# Altium schematic sheet Master_2.SchDoc
size A4
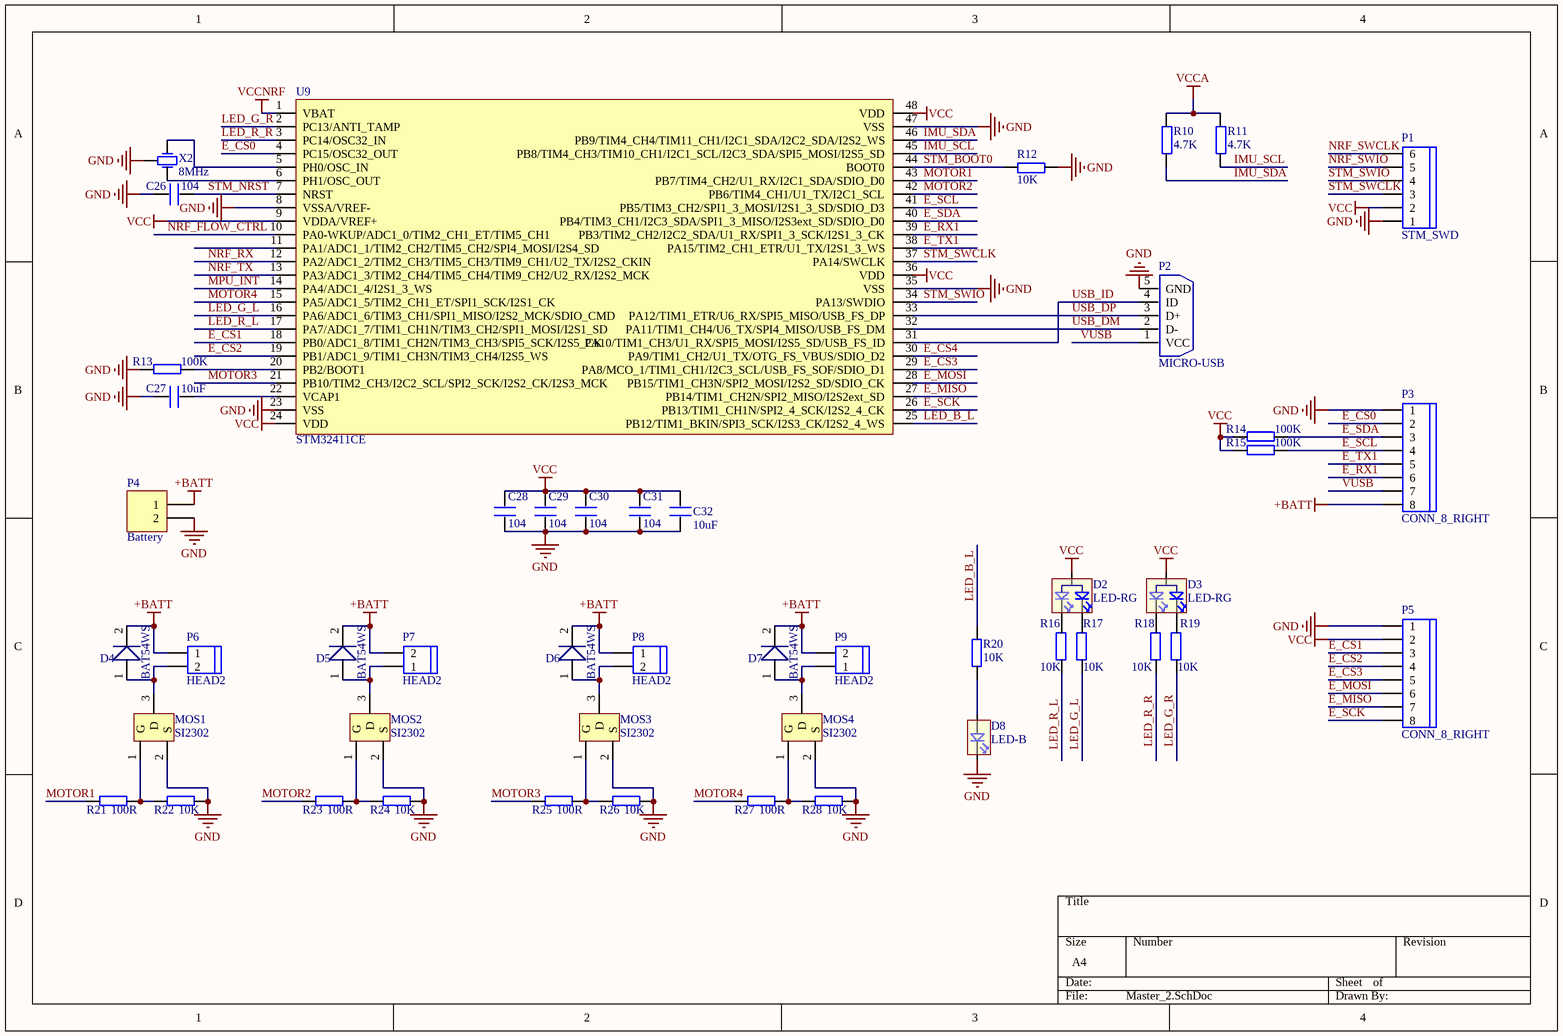
[diagram p0: Master_2.SchDoc]

## Parts
C26  104  [0402]
C27  10uF  [0603P]
C28  104  [0402]
C29  104  [0402]
C30  104  [0402]
C31  104  [0402]
C32  10uF  [0603P]
D2  LED-RG  [LED1206  侧贴]
D3  LED-RG  [LED1206  侧贴]
D4  BAT54WS  [SOD-323]
D5  BAT54WS  [SOD-323]
D6  BAT54WS  [SOD-323]
D7  BAT54WS  [SOD-323]
D8  LED-B  [LED1206  侧贴]
MOS1  SI2302  [SO-G3/C2.5]
MOS2  SI2302  [SO-G3/C2.5]
MOS3  SI2302  [SO-G3/C2.5]
MOS4  SI2302  [SO-G3/C2.5]
P1  STM_SWD  [SH1.0-6P]
P2  MICRO-USB  [MICRO_USB5P_SOP]
P3  CONN_8_RIGHT  [HEADER8-2.0MM-SMD]
P4  Battery  [HDR1X2]
P5  CONN_8_RIGHT  [HEADER8-2.0MM-SMD]
P6  HEAD2  [HEADER2-1.25MM]
P7  HEAD2  [HEADER2-1.25MM]
P8  HEAD2  [HEADER2-1.25MM]
P9  HEAD2  [HEADER2-1.25MM]
R10  4.7K  [0402]
R11  4.7K  [0402]
R12  10K  [0402]
R13  100K  [0402]
R14  100K  [0402]
R15  100K  [0402]
R16  10K  [0402]
R17  10K  [0402]
R18  10K  [0402]
R19  10K  [0402]
R20  10K  [0402]
R21  100R  [0402]
R22  10K  [0402]
R23  100R  [0402]
R24  10K  [0402]
R25  100R  [0402]
R26  10K  [0402]
R27  100R  [0402]
R28  10K  [0402]
U9  STM32411CE  [UFQFPN48]
X2  8MHz  [XTAL3215]

## Nets
+BATT: D4.2 D5.2 D6.2 D7.2 P3.8 P4.1 P6.1 P7.2 P8.1 P9.2
GND: C26.1 C27.1 C28.1 C29.1 C30.1 C31.1 C32.1 D8.1 MOS1.2(S) MOS2.2(S) MOS3.2(S) MOS4.2(S) P1.1 P2.5(GND) P3.1 P4.2 P5.1 R12.2 R13.2 R22.1 R24.1 R26.1 R28.1 U9.8(VSSA/VREF-) U9.23(VSS) U9.35(VSS) U9.47(VSS) X2.2(GND)
VCC: C28.2 C29.2 C30.2 C31.2 C32.2 D2.3 D3.3 P1.2 P5.2 R14.2 R15.2 U9.9(VDDA/VREF+) U9.24(VDD) U9.36(VDD) U9.48(VDD)
VCCA: R10.2 R11.2
VCCNRF: U9.1(VBAT)
E_CS0: P3.2 U9.4(PC15/OSC32_OUT)
E_CS1: P5.3 U9.18(PB0/ADC1_8/TIM1_CH2N/TIM3_CH3/SPI5_SCK/I2S5_CK)
E_CS2: P5.4 U9.19(PB1/ADC1_9/TIM1_CH3N/TIM3_CH4/I2S5_WS)
E_CS3: P5.5 U9.29(PA8/MCO_1/TIM1_CH1/I2C3_SCL/USB_FS_SOF/SDIO_D1)
E_CS4: U9.30(PA9/TIM1_CH2/U1_TX/OTG_FS_VBUS/SDIO_D2)
E_MISO: P5.7 U9.27(PB14/TIM1_CH2N/SPI2_MISO/I2S2ext_SD)
E_MOSI: P5.6 U9.28(PB15/TIM1_CH3N/SPI2_MOSI/I2S2_SD/SDIO_CK)
E_RX1: P3.6 U9.39(PB3/TIM2_CH2/I2C2_SDA/U1_RX/SPI1_3_SCK/I2S1_3_CK)
E_SCK: P5.8 U9.26(PB13/TIM1_CH1N/SPI2_4_SCK/I2S2_4_CK)
E_SCL: P3.4 R15.1 U9.41(PB5/TIM3_CH2/SPI1_3_MOSI/I2S1_3_SD/SDIO_D3)
E_SDA: P3.3 R14.1 U9.40(PB4/TIM3_CH1/I2C3_SDA/SPI1_3_MISO/I2S3ext_SD/SDIO_D0)
E_TX1: P3.5 U9.38(PA15/TIM2_CH1_ETR/U1_TX/I2S1_3_WS)
IMU_SCL: R11.1 U9.45(PB8/TIM4_CH3/TIM10_CH1/I2C1_SCL/I2C3_SDA/SPI5_MOSI/I2S5_SD)
IMU_SDA: R10.1 U9.46(PB9/TIM4_CH4/TIM11_CH1/I2C1_SDA/I2C2_SDA/I2S2_WS)
LED_B_L: R20.1 U9.25(PB12/TIM1_BKIN/SPI3_SCK/I2S3_CK/I2S2_4_WS)
LED_G_L: R17.2 U9.16(PA6/ADC1_6/TIM3_CH1/SPI1_MISO/I2S2_MCK/SDIO_CMD)
LED_G_R: R19.2 U9.2(PC13/ANTI_TAMP)
LED_R_L: R16.2 U9.17(PA7/ADC1_7/TIM1_CH1N/TIM3_CH2/SPI1_MOSI/I2S1_SD)
LED_R_R: R18.2 U9.3(PC14/OSC32_IN)
MOTOR1: R21.2 U9.43(PB7/TIM4_CH2/U1_RX/I2C1_SDA/SDIO_D0)
MOTOR2: R23.2 U9.42(PB6/TIM4_CH1/U1_TX/I2C1_SCL)
MOTOR3: R25.2 U9.21(PB10/TIM2_CH3/I2C2_SCL/SPI2_SCK/I2S2_CK/I2S3_MCK)
MOTOR4: R27.2 U9.15(PA5/ADC1_5/TIM2_CH1_ET/SPI1_SCK/I2S1_CK)
MPU_INT: U9.14(PA4/ADC1_4/I2S1_3_WS)
NRF_FLOW_CTRL: U9.10(PA0-WKUP/ADC1_0/TIM2_CH1_ET/TIM5_CH1)
NRF_RX: U9.12(PA2/ADC1_2/TIM2_CH3/TIM5_CH3/TIM9_CH1/U2_TX/I2S2_CKIN)
NRF_SWCLK: P1.6
NRF_SWIO: P1.5
NRF_TX: U9.13(PA3/ADC1_3/TIM2_CH4/TIM5_CH4/TIM9_CH2/U2_RX/I2S2_MCK)
STM_BOOT0: R12.1 U9.44(BOOT0)
STM_NRST: C26.2 U9.7(NRST)
STM_SWCLK: P1.3 U9.37(PA14/SWCLK)
STM_SWIO: P1.4 U9.34(PA13/SWDIO)
USB_DM: P2.2(D-) U9.32(PA11/TIM1_CH4/U6_TX/SPI4_MISO/USB_FS_DM)
USB_DP: P2.3(D+) U9.33(PA12/TIM1_ETR/U6_RX/SPI5_MISO/USB_FS_DP)
USB_ID: P2.4(ID) U9.31(PA10/TIM1_CH3/U1_RX/SPI5_MOSI/I2S5_SD/USB_FS_ID)
VUSB: P2.1(VCC) P3.7
NetC27_2: C27.2 U9.22(VCAP1)
NetD2_1: D2.1 R16.1
NetD2_2: D2.2 R17.1
NetD3_1: D3.1 R18.1
NetD3_2: D3.2 R19.1
NetD4_1: D4.1 MOS1.3(D) P6.2
NetD5_1: D5.1 MOS2.3(D) P7.1
NetD6_1: D6.1 MOS3.3(D) P8.2
NetD7_1: D7.1 MOS4.3(D) P9.1
NetD8_3: D8.3 R20.2
NetMOS1_1: MOS1.1(G) R21.1 R22.2
NetMOS2_1: MOS2.1(G) R23.1 R24.2
NetMOS3_1: MOS3.1(G) R25.1 R26.2
NetMOS4_1: MOS4.1(G) R27.1 R28.2
NetR13_1: R13.1 U9.20(PB2/BOOT1)
NetU9_5: U9.5(PH0/OSC_IN) X2.1(OSC1)
NetU9_6: U9.6(PH1/OSC_OUT) X2.3(OSC2)

Not connected (* = marked no-connect by the designer): D8 2; U9 11(PA1/ADC1_1/TIM2_CH2/TIM5_CH2/SPI4_MOSI/I2S4_SD)

## Library data of the parts
C26-C32 = C
D2 D3 = LED 1206 侧贴 双色
D4-D7 = BAT54: 单肖特基二极管
D8 = LED 1206 侧贴  单色
MOS1-MOS4 = MOS-N: AP2306
P1 = HEAD6
P2 = USB5
P3 P5 = HEAD8
P4 = Header 2: Header, 2-Pin; LatestRevisionDate: 17-Jul-2002; LatestRevisionNote: Re-released for DXP Platform.; Publisher: Altium Limited
R10-R28 = R
U9 = STM32F411xC_xE: STM32411xC_xE
X2 = XTAL-3215